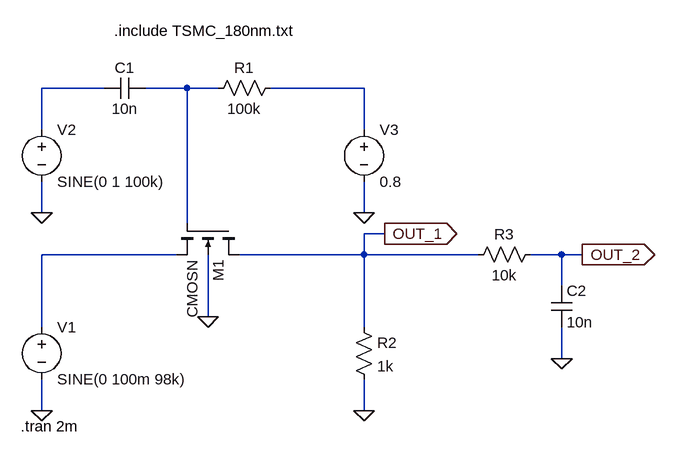
[diagram p0: schematic MIXER WITH LPF.asc]
MIXER WITH LPF.asc, the LTspice schematic file:
Version 4
SHEET 1 880 680
WIRE -64 -128 -160 -128
WIRE 64 -128 0 -128
WIRE 112 -128 64 -128
WIRE 336 -128 192 -128
WIRE -160 -64 -160 -128
WIRE 336 -64 336 -128
WIRE -160 64 -160 16
WIRE 336 64 336 16
WIRE 64 80 64 -128
WIRE 368 96 336 96
WIRE 48 128 -160 128
WIRE 336 128 336 96
WIRE 336 128 144 128
WIRE 512 128 336 128
WIRE 640 128 592 128
WIRE 672 128 640 128
WIRE 640 176 640 128
WIRE 96 224 96 128
WIRE -160 240 -160 128
WIRE 336 240 336 128
WIRE 640 288 640 240
WIRE -160 368 -160 320
WIRE 336 368 336 320
FLAG 336 64 0
FLAG -160 64 0
FLAG -160 368 0
FLAG 336 368 0
FLAG 96 224 0
FLAG 640 288 0
FLAG 672 128 OUT_2
IOPIN 672 128 Out
FLAG 368 96 OUT_1
IOPIN 368 96 Out
SYMBOL nmos4 144 80 R90
SYMATTR InstName M1
SYMATTR Value CMOSN
SYMBOL voltage -160 224 R0
WINDOW 123 0 0 Left 0
WINDOW 39 0 0 Left 0
SYMATTR InstName V1
SYMATTR Value SINE(0 100m 98k)
SYMBOL voltage -160 -80 R0
WINDOW 123 0 0 Left 0
WINDOW 39 0 0 Left 0
SYMATTR InstName V2
SYMATTR Value SINE(0 1 100k)
SYMBOL cap 0 -144 R90
WINDOW 0 0 32 VBottom 2
WINDOW 3 32 32 VTop 2
SYMATTR InstName C1
SYMATTR Value 10n
SYMBOL res 208 -144 R90
WINDOW 0 0 56 VBottom 2
WINDOW 3 32 56 VTop 2
SYMATTR InstName R1
SYMATTR Value 100k
SYMBOL voltage 336 -80 R0
WINDOW 123 0 0 Left 0
WINDOW 39 0 0 Left 0
SYMATTR InstName V3
SYMATTR Value 0.8
SYMBOL res 320 224 R0
SYMATTR InstName R2
SYMATTR Value 1k
SYMBOL cap 624 176 R0
SYMATTR InstName C2
SYMATTR Value 10n
SYMBOL res 608 112 R90
WINDOW 0 0 56 VBottom 2
WINDOW 3 32 56 VTop 2
SYMATTR InstName R3
SYMATTR Value 10k
TEXT -48 -216 Left 2 !.include TSMC_180nm.txt
TEXT -192 392 Left 2 !.tran 2m

The netlist it stands for:
* MIXER WITH LPF.asc
M1 OUT_1 N002 N004 0 CMOSN
V1 N004 0 SINE(0 100m 98k)
V2 N001 0 SINE(0 1 100k)
C1 N002 N001 10n
R1 N003 N002 100k
V3 N003 0 0.8
R2 OUT_1 0 1k
C2 OUT_2 0 10n
R3 OUT_2 OUT_1 10k
.model NMOS NMOS
.model PMOS PMOS
.lib standard.mos
.include TSMC_180nm.txt
.tran 2m
.backanno
.end